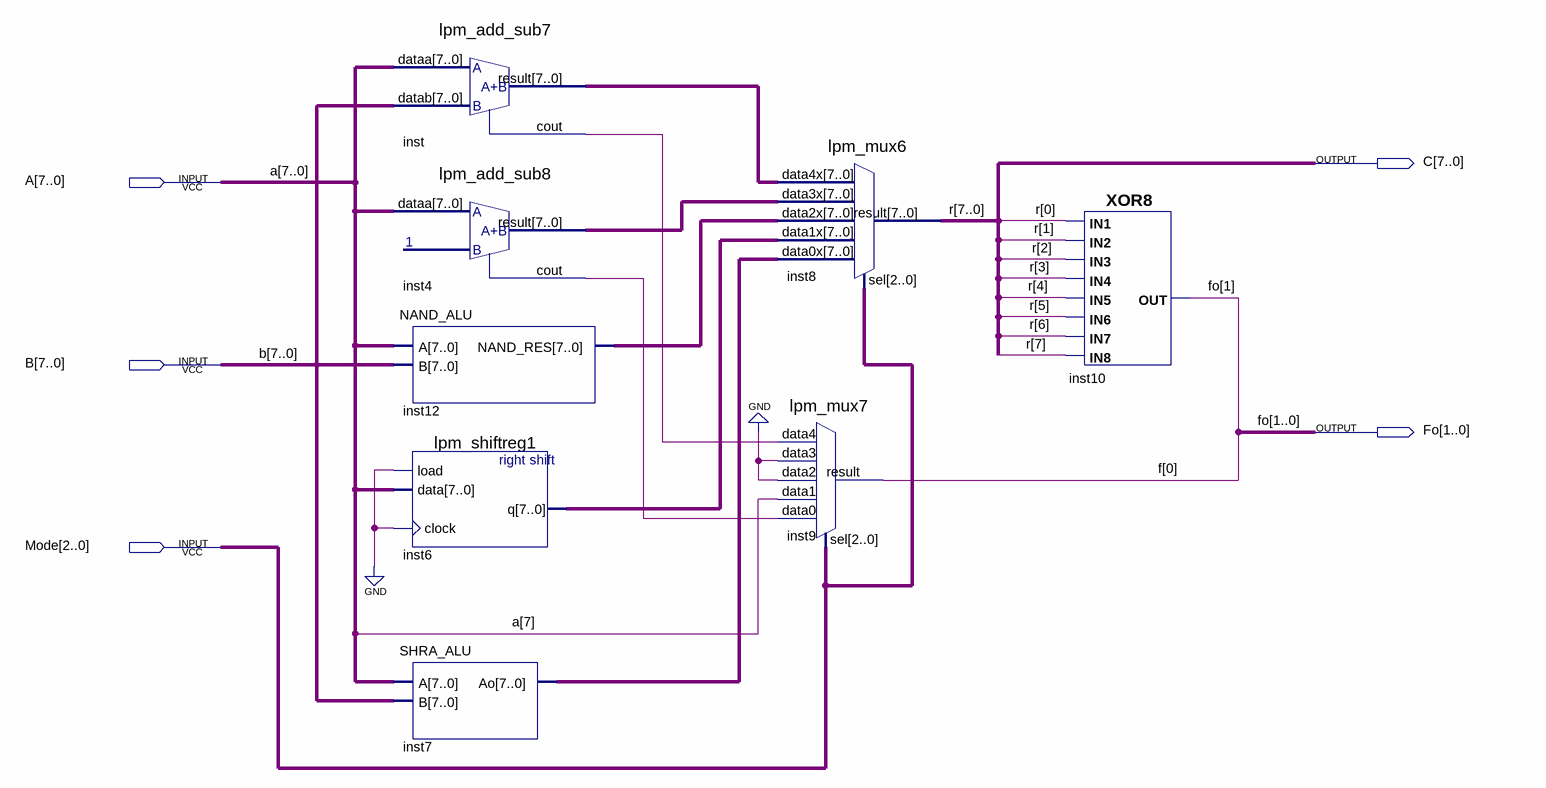
[diagram p0: schematic sheet]
// Quartus schematic TRUe_ALU_V2.bdf as structural Verilog: 8 symbols, 5 pins
module TRUe_ALU_V2 (
  input  [7:0] A,
  input  [7:0] B,
  input  [2:0] Mode,
  output [7:0] C,
  output [1:0] Fo
);

  wire inst4_cout, inst_cout;
  wire [0:0] f;
  wire [7:0] inst4_result, inst6_q, inst7_ao, inst12_nand_res, inst_result;

  lpm_add_sub7 inst (.dataa(A), .datab(B), .result(inst_result), .cout(inst_cout));
  lpm_add_sub8 inst4 (.dataa(A), .result(inst4_result), .cout(inst4_cout));
  NAND_ALU inst12 (.A(A), .B(B), .NAND_RES(inst12_nand_res));
  lpm_shiftreg1 inst6 (.load(1'b0), .data(A), .clock(1'b0), .q(inst6_q));
  SHRA_ALU inst7 (.A(A), .B(B), .Ao(inst7_ao));
  lpm_mux6 inst8 (
    .data4x(inst_result), .data3x(inst4_result), .data2x(inst12_nand_res), .data1x(inst6_q),
    .data0x(inst7_ao), .sel(Mode), .result(C));
  lpm_mux7 inst9 (
    .data4(inst_cout), .data3(1'b0), .data2(1'b0), .data1(A[7]), .data0(inst4_cout), .sel(Mode), .result(f[0]));
  XOR8 inst10 (
    .IN8(C[7]), .IN1(C[0]), .IN7(C[6]), .IN6(C[5]), .IN5(C[4]), .IN4(C[3]), .IN3(C[2]), .IN2(C[1]),
    .OUT(Fo[1]));

  // Other names for the same wires on the sheet: r[7:0] = C
endmodule
